# Altium schematic sheet Codec.SchDoc
size 420 x 297 mm; DocumentNumber: CODEC FRONT 7"; SheetNumber: 4; SheetTotal: 6
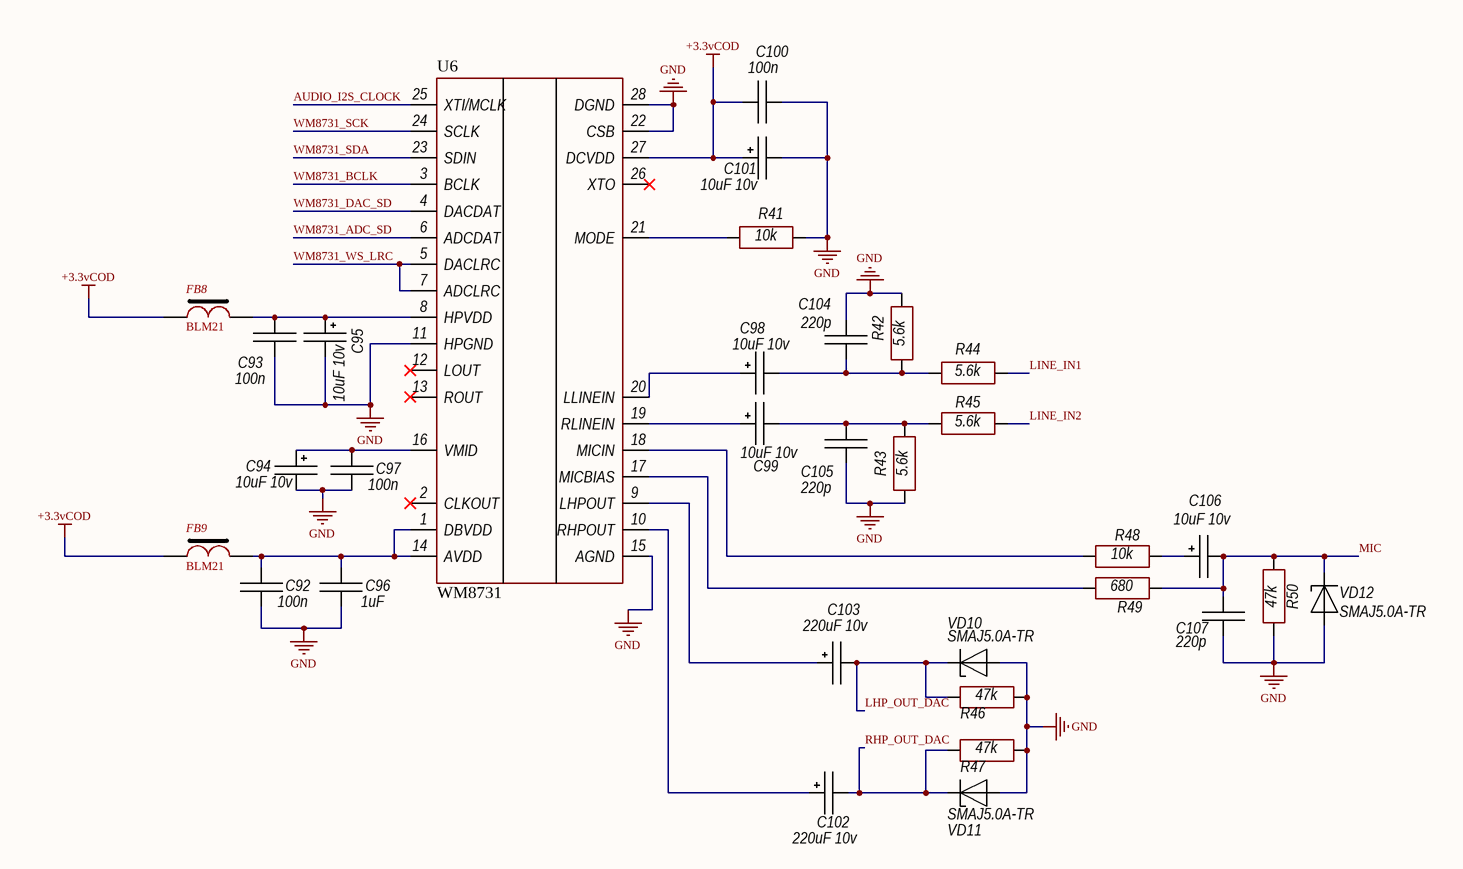
[diagram p0: Codec.SchDoc]

## Parts
C92  100n  [CH0805C]
C93  100n  [CH0805C]
C94  10uF 10v  [TANTAL_B]
C95  10uF 10v  [TANTAL_B]
C96  1uF  [CH0805C]
C97  100n  [CH0805C]
C98  10uF 10v  [TANTAL_B]
C99  10uF 10v  [TANTAL_B]
C100  100n  [CH0805C]
C101  10uF 10v  [TANTAL_B]
C102  220uF 10v  [TANTAL_D]
C103  220uF 10v  [TANTAL_D]
C104  220p  [CH0805C]
C105  220p  [CH0805C]
C106  10uF 10v  [TANTAL_B]
C107  220p  [CH0805C]
FB8  BLM21  [CH0805L]
FB9  BLM21  [CH0805L]
R41  10k  [CH0805R]
R42  5.6k  [CH0805R]
R43  5.6k  [CH0805R]
R44  5.6k  [CH0805R]
R45  5.6k  [CH0805R]
R46  47k  [CH0805R]
R47  47k  [CH0805R]
R48  10k  [CH0805R]
R49  680  [CH0805R]
R50  47k  [CH0805R]
U6  WM8731  [28-SSOP]
VD10  SMAJ5.0A-TR  [SMA]
VD11  SMAJ5.0A-TR  [SMA]
VD12  SMAJ5.0A-TR  [SMA]

## Nets
+3.3vCOD: C100.1 C101.1 FB8.2 FB9.2 U6.27(DCVDD)
GND: C92.1 C93.1 C94.2 C95.2 C96.1 C97.1 C100.2 C101.2 C104.2 C105.1 C107.2 R41.2 R42.2 R43.1 R46.2 R47.2 R50.1 U6.11(HPGND) U6.15(AGND) U6.22(CSB) U6.28(DGND) VD10.1(A) VD11.1(A) VD12.1(A)
AUDIO_I2S_CLOCK: U6.25(XTI/MCLK)
LHP_OUT_DAC: C103.2 R46.1 VD10.2(C)
LINE_IN1: R44.2
LINE_IN2: R45.2
MIC: C106.2 C107.1 R49.2 R50.2 VD12.2(C)
RHP_OUT_DAC: C102.2 R47.1 VD11.2(C)
WM8731_ADC_SD: U6.6(ADCDAT)
WM8731_BCLK: U6.3(BCLK)
WM8731_DAC_SD: U6.4(DACDAT)
WM8731_SCK: U6.24(SCLK)
WM8731_SDA: U6.23(SDIN)
WM8731_WS_LRC: U6.5(DACLRC) U6.7(ADCLRC)
NetC92_2: C92.2 C96.2 FB9.1 U6.1(DBVDD) U6.14(AVDD)
NetC93_2: C93.2 C95.1 FB8.1 U6.8(HPVDD)
NetC94_1: C94.1 C97.2 U6.16(VMID)
NetC98_1: C98.1 U6.20(LLINEIN)
NetC98_2: C98.2 C104.1 R42.1 R44.1
NetC99_1: C99.1 U6.19(RLINEIN)
NetC99_2: C99.2 C105.2 R43.2 R45.1
NetC102_1: C102.1 U6.10(RHPOUT)
NetC103_1: C103.1 U6.9(LHPOUT)
NetC106_1: C106.1 R48.2
NetR41_1: R41.1 U6.21(MODE)
NetR48_1: R48.1 U6.18(MICIN)
NetR49_1: R49.1 U6.17(MICBIAS)

Not connected (* = marked no-connect by the designer): U6 2(CLKOUT)* 12(LOUT)* 13(ROUT)* 26(XTO)*

## Notes on the sheet
- Подп. и дата
- Инв. № дубл.
- Взам. инв. №
- Инв. № подл.
- Изм.
- Лист
- № докум.
- Подп.
- Дата
- 2.106-A3
- Копировал
- Формат А3

## Library data of the parts
C92 C93 C96 C97 C100 C104 C105 C107 = Capacitor: Manufacturer: *; Model: *; HelpURL: *; ComponentKind: *; Value: *
C94 C95 C98 C99 C101-C103 C106 = TantalCap: Manufacturer: *; Model: *; HelpURL: *; ComponentKind: *; Value: *
FB8 FB9 = FB-1
R41-R50 = Resistor: Manufacturer: *; Model: *; HelpURL: *; ComponentKind: *; Value: *
VD10-VD12 = Diod Zener: ComponentKind: *; Manufacturer: *; Model: *; HelpURL: *